# Altium project MyNixie.PrjPCB
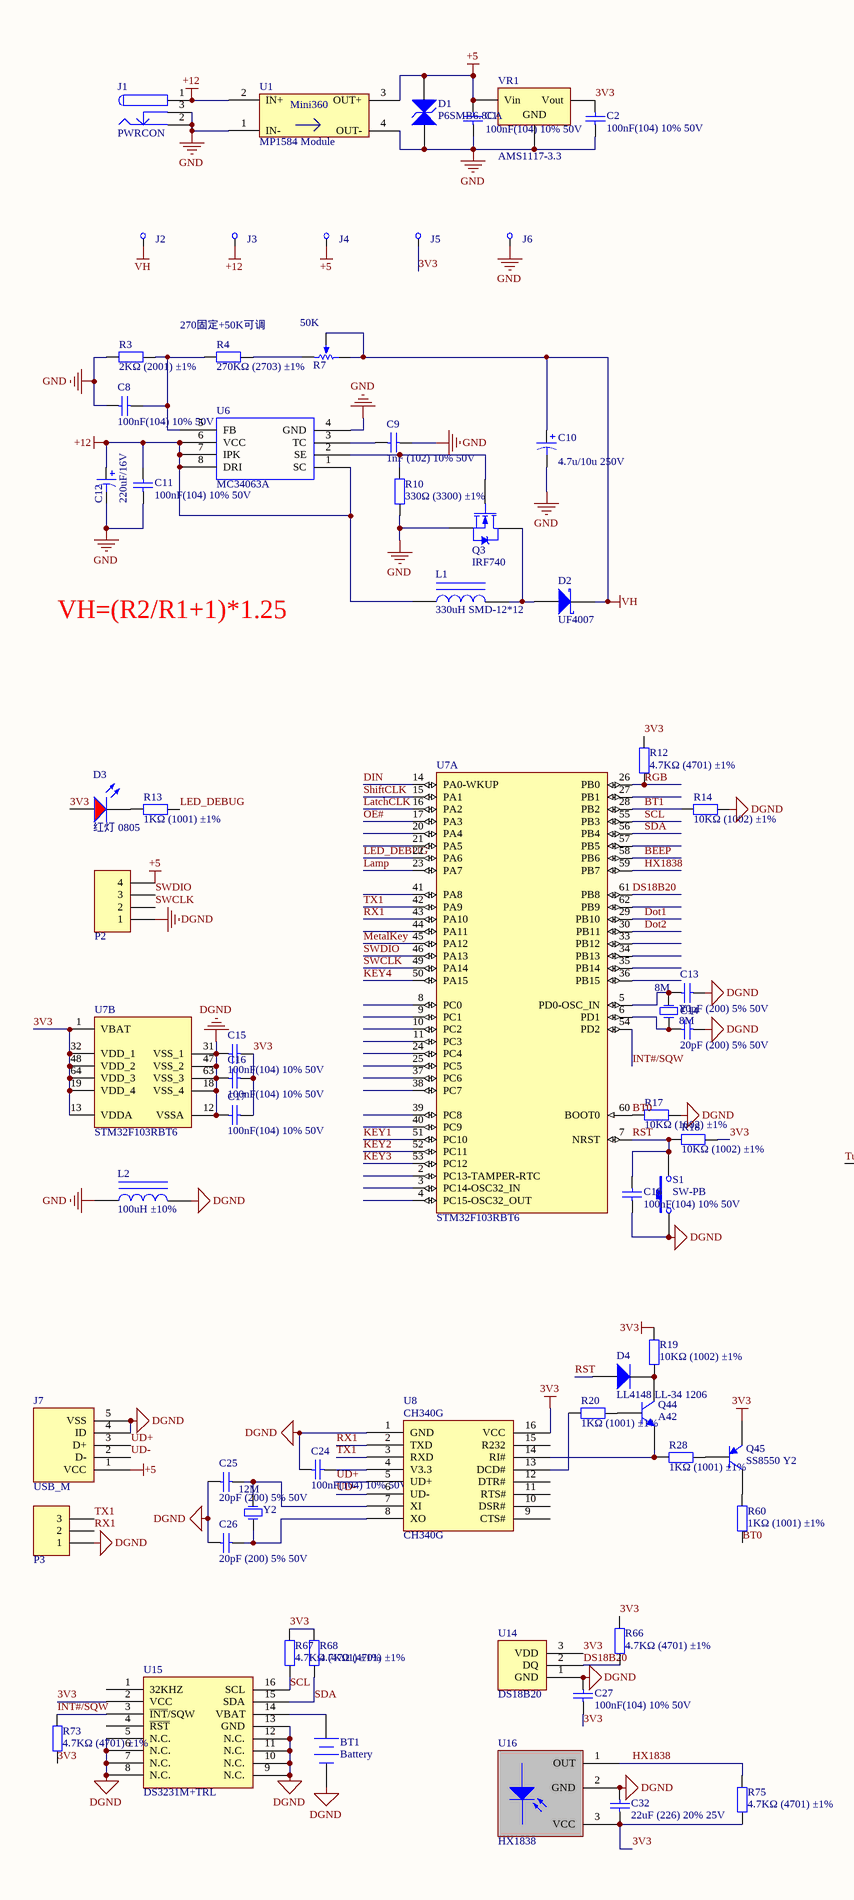
[diagram p0: MyNixie.SchDoc, left]
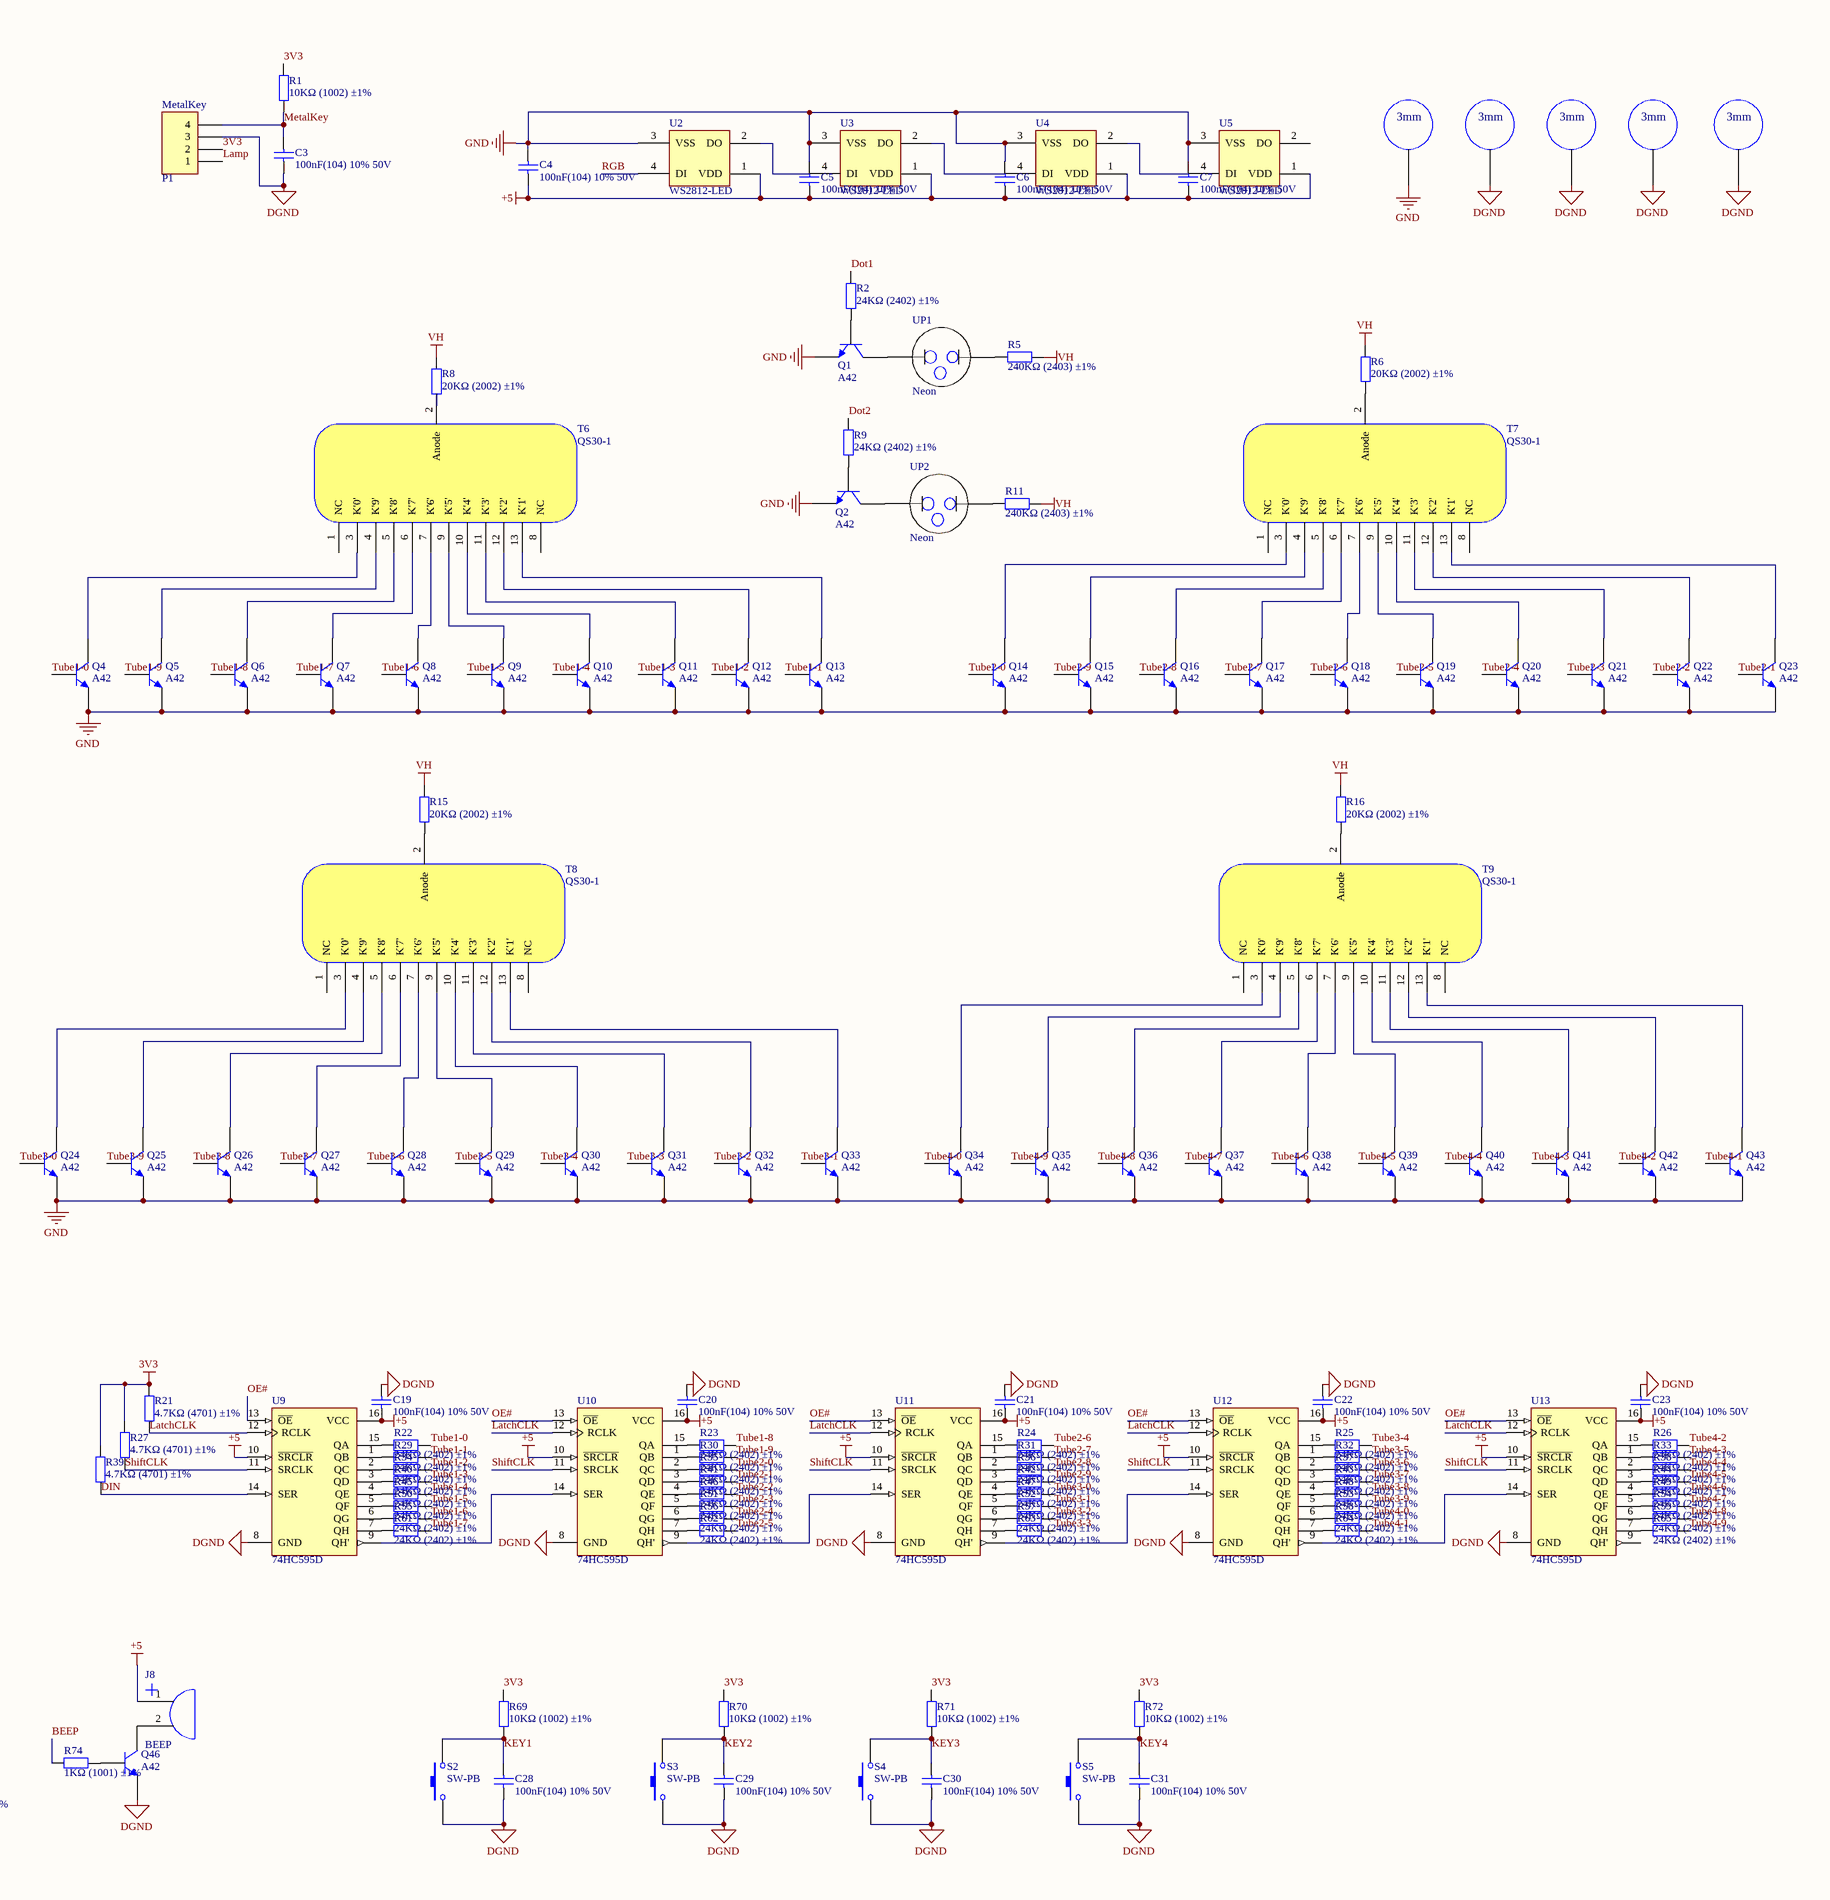
[diagram p1: MyNixie.SchDoc, right]
1 sheet, 206 parts. Net scope: global (net labels, ports and power ports of the same name join across sheets).
Board file: MyNixie.PcbDoc

## Sheet MyNixie.SchDoc
size A2

### Parts
BT1  Battery  [CR1220]
C1  100nF(104) 10% 50V  [0805_C]
C2  100nF(104) 10% 50V  [0805_C]
C3  100nF(104) 10% 50V  [0805_C]
C4  100nF(104) 10% 50V  [0805_C]
C5  100nF(104) 10% 50V  [0805_C]
C6  100nF(104) 10% 50V  [0805_C]
C7  100nF(104) 10% 50V  [0805_C]
C8  100nF(104) 10% 50V  [0805_C]
C9  1nF (102) 10% 50V  [0805_C]
C10  4.7u/10u 250V  [C-RB-8]
C11  100nF(104) 10% 50V  [0805_C]
C12  220uF/16V  [C-RB-S6]
C13  20pF (200) 5% 50V  [0805_C]
C14  20pF (200) 5% 50V  [0805_C]
C15  100nF(104) 10% 50V  [0805_C]
C16  100nF(104) 10% 50V  [0805_C]
C17  100nF(104) 10% 50V  [0805_C]
C18  100nF(104) 10% 50V  [0805_C]
C19  100nF(104) 10% 50V  [0805_C]
C20  100nF(104) 10% 50V  [0805_C]
C21  100nF(104) 10% 50V  [0805_C]
C22  100nF(104) 10% 50V  [0805_C]
C23  100nF(104) 10% 50V  [0805_C]
C24  100nF(104) 10% 50V  [0805_C]
C25  20pF (200) 5% 50V  [0805_C]
C26  20pF (200) 5% 50V  [0805_C]
C27  100nF(104) 10% 50V  [0805_C]
C28  100nF(104) 10% 50V  [0805_C]
C29  100nF(104) 10% 50V  [0805_C]
C30  100nF(104) 10% 50V  [0805_C]
C31  100nF(104) 10% 50V  [0805_C]
C32  22uF (226) 20% 25V  [0805_C]
D1  P6SMB6.8CA  [SMB(DO-214AA)_S1]
D2  UF4007  [SMA(DO-214AC)_S1]
D3  红灯 0805  [0805_LED_S1]
D4  LL4148 LL-34 1206  [LL-34]
J1  PWRCON  [DC-005]
J2  CHECK  [CHECK-B]  (value not drawn)
J3  CHECK  [CHECK-B]  (value not drawn)
J4  CHECK  [CHECK-B]  (value not drawn)
J5  CHECK  [CHECK-B]  (value not drawn)
J6  CHECK  [CHECK-B]  (value not drawn)
J7  USB_M  [USB_MICRO]
J8  BEEP  [Beep-12095]
L1  330uH SMD-12*12  [L-SMD-12]
L2  100uH ±10%  [0805_L]
P1  MetalKey  [HDR4X1_A]
P2  Header 4  [HDR4X1_A]  (value not drawn)
P3  Header 3  [HDR3X1_A]  (value not drawn)
Q1  A42  [SOT-23(SOT-23-3)]
Q2  A42  [SOT-23(SOT-23-3)]
Q3  IRF740  [TO-263-2]
Q4  A42  [SOT-23(SOT-23-3)]
Q5  A42  [SOT-23(SOT-23-3)]
Q6  A42  [SOT-23(SOT-23-3)]
Q7  A42  [SOT-23(SOT-23-3)]
Q8  A42  [SOT-23(SOT-23-3)]
Q9  A42  [SOT-23(SOT-23-3)]
Q10  A42  [SOT-23(SOT-23-3)]
Q11  A42  [SOT-23(SOT-23-3)]
Q12  A42  [SOT-23(SOT-23-3)]
Q13  A42  [SOT-23(SOT-23-3)]
Q14  A42  [SOT-23(SOT-23-3)]
Q15  A42  [SOT-23(SOT-23-3)]
Q16  A42  [SOT-23(SOT-23-3)]
Q17  A42  [SOT-23(SOT-23-3)]
Q18  A42  [SOT-23(SOT-23-3)]
Q19  A42  [SOT-23(SOT-23-3)]
Q20  A42  [SOT-23(SOT-23-3)]
Q21  A42  [SOT-23(SOT-23-3)]
Q22  A42  [SOT-23(SOT-23-3)]
Q23  A42  [SOT-23(SOT-23-3)]
Q24  A42  [SOT-23(SOT-23-3)]
Q25  A42  [SOT-23(SOT-23-3)]
Q26  A42  [SOT-23(SOT-23-3)]
Q27  A42  [SOT-23(SOT-23-3)]
Q28  A42  [SOT-23(SOT-23-3)]
Q29  A42  [SOT-23(SOT-23-3)]
Q30  A42  [SOT-23(SOT-23-3)]
Q31  A42  [SOT-23(SOT-23-3)]
Q32  A42  [SOT-23(SOT-23-3)]
Q33  A42  [SOT-23(SOT-23-3)]
Q34  A42  [SOT-23(SOT-23-3)]
Q35  A42  [SOT-23(SOT-23-3)]
Q36  A42  [SOT-23(SOT-23-3)]
Q37  A42  [SOT-23(SOT-23-3)]
Q38  A42  [SOT-23(SOT-23-3)]
Q39  A42  [SOT-23(SOT-23-3)]
Q40  A42  [SOT-23(SOT-23-3)]
Q41  A42  [SOT-23(SOT-23-3)]
Q42  A42  [SOT-23(SOT-23-3)]
Q43  A42  [SOT-23(SOT-23-3)]
Q44  A42  [SOT-23(SOT-23-3)]
Q45  SS8550 Y2  [SOT-23(SOT-23-3)]
Q46  A42  [SOT-23(SOT-23-3)]
R1  10KΩ (1002) ±1%  [0805_R]
R2  24KΩ (2402) ±1%  [0805_R]
R3  2KΩ (2001) ±1%  [0805_R]
R4  270KΩ (2703) ±1%  [0805_R]
R5  240KΩ (2403) ±1%  [0805_R]
R6  20KΩ (2002) ±1%  [0805_R]
R7  50K  [VR_B1]
R8  20KΩ (2002) ±1%  [0805_R]
R9  24KΩ (2402) ±1%  [0805_R]
R10  330Ω (3300) ±1%  [0805_R]
R11  240KΩ (2403) ±1%  [0805_R]
R12  4.7KΩ (4701) ±1%  [0805_R]
R13  1KΩ (1001) ±1%  [0805_R]
R14  10KΩ (1002) ±1%  [0805_R]
R15  20KΩ (2002) ±1%  [0805_R]
R16  20KΩ (2002) ±1%  [0805_R]
R17  10KΩ (1002) ±1%  [0805_R]
R18  10KΩ (1002) ±1%  [0805_R]
R19  10KΩ (1002) ±1%  [0805_R]
R20  1KΩ (1001) ±1%  [0805_R]
R21  4.7KΩ (4701) ±1%  [0805_R]
R22  24KΩ (2402) ±1%  [0805_R]
R23  24KΩ (2402) ±1%  [0805_R]
R24  24KΩ (2402) ±1%  [0805_R]
R25  24KΩ (2402) ±1%  [0805_R]
R26  24KΩ (2402) ±1%  [0805_R]
R27  4.7KΩ (4701) ±1%  [0805_R]
R28  1KΩ (1001) ±1%  [0805_R]
R29  24KΩ (2402) ±1%  [0805_R]
R30  24KΩ (2402) ±1%  [0805_R]
R31  24KΩ (2402) ±1%  [0805_R]
R32  24KΩ (2402) ±1%  [0805_R]
R33  24KΩ (2402) ±1%  [0805_R]
R34  24KΩ (2402) ±1%  [0805_R]
R35  24KΩ (2402) ±1%  [0805_R]
R36  24KΩ (2402) ±1%  [0805_R]
R37  24KΩ (2402) ±1%  [0805_R]
R38  24KΩ (2402) ±1%  [0805_R]
R39  4.7KΩ (4701) ±1%  [0805_R]
R40  24KΩ (2402) ±1%  [0805_R]
R41  24KΩ (2402) ±1%  [0805_R]
R42  24KΩ (2402) ±1%  [0805_R]
R43  24KΩ (2402) ±1%  [0805_R]
R44  24KΩ (2402) ±1%  [0805_R]
R45  24KΩ (2402) ±1%  [0805_R]
R46  24KΩ (2402) ±1%  [0805_R]
R47  24KΩ (2402) ±1%  [0805_R]
R48  24KΩ (2402) ±1%  [0805_R]
R49  24KΩ (2402) ±1%  [0805_R]
R50  24KΩ (2402) ±1%  [0805_R]
R51  24KΩ (2402) ±1%  [0805_R]
R52  24KΩ (2402) ±1%  [0805_R]
R53  24KΩ (2402) ±1%  [0805_R]
R54  24KΩ (2402) ±1%  [0805_R]
R55  24KΩ (2402) ±1%  [0805_R]
R56  24KΩ (2402) ±1%  [0805_R]
R57  24KΩ (2402) ±1%  [0805_R]
R58  24KΩ (2402) ±1%  [0805_R]
R59  24KΩ (2402) ±1%  [0805_R]
R60  1KΩ (1001) ±1%  [0805_R]
R61  24KΩ (2402) ±1%  [0805_R]
R62  24KΩ (2402) ±1%  [0805_R]
R63  24KΩ (2402) ±1%  [0805_R]
R64  24KΩ (2402) ±1%  [0805_R]
R65  24KΩ (2402) ±1%  [0805_R]
R66  4.7KΩ (4701) ±1%  [0805_R]
R67  4.7KΩ (4701) ±1%  [0805_R]
R68  4.7KΩ (4701) ±1%  [0805_R]
R69  10KΩ (1002) ±1%  [0805_R]
R70  10KΩ (1002) ±1%  [0805_R]
R71  10KΩ (1002) ±1%  [0805_R]
R72  10KΩ (1002) ±1%  [0805_R]
R73  4.7KΩ (4701) ±1%  [0805_R]
R74  1KΩ (1001) ±1%  [0805_R]
R75  4.7KΩ (4701) ±1%  [0805_R]
S1  SW-PB  [SW_PB2_A1]
S2  SW-PB  [SW_PB2_A1]
S3  SW-PB  [SW_PB2_A1]
S4  SW-PB  [SW_PB2_A1]
S5  SW-PB  [SW_PB2_A1]
T1  M3铜柱螺丝孔  [螺丝孔-3mm]  (value not drawn)
T2  M3铜柱螺丝孔  [螺丝孔-3mm]  (value not drawn)
T3  M3铜柱螺丝孔  [螺丝孔-3mm]  (value not drawn)
T4  M3铜柱螺丝孔  [螺丝孔-3mm]  (value not drawn)
T5  M3铜柱螺丝孔  [螺丝孔-3mm]  (value not drawn)
T6  QS30-1  [QS30-1]
T7  QS30-1  [QS30-1]
T8  QS30-1  [QS30-1]
T9  QS30-1  [QS30-1]
U1  MP1584 Module  [MP1584 Module]
U2  WS2812-LED  [WS2812]
U3  WS2812-LED  [WS2812]
U4  WS2812-LED  [WS2812]
U5  WS2812-LED  [WS2812]
U6  MC34063A  [SOIC-8_150mil]
U7  STM32F103RBT6  [LQFP-64_10x10x05P]  (parts A,B of 2)
U8  CH340G  [SOIC-16_150mil]
U9  74HC595D  [SOIC-16_150mil]
U10  74HC595D  [SOIC-16_150mil]
U11  74HC595D  [SOIC-16_150mil]
U12  74HC595D  [SOIC-16_150mil]
U13  74HC595D  [SOIC-16_150mil]
U14  DS18B20  [TO-92A]
U15  DS3231M+TRL  [SOIC-16_300mil]
U16  HX1838  [HS0038B]
UP1  Neon  [Neon]
UP2  Neon  [Neon]
VR1  AMS1117-3.3  [SOT-223]
Y1  8M  [X-SM49]
Y2  12M  [X-SM49]

### Nets
3V3: C2.2 C15.1 C16.1 C17.1 C27.2 C32.1 D3.A J5.1 P1.2 Q45.2(E) R1.1 R12.2 R18.1 R19.2 R21.1 R27.1 R39.1 R66.2 R67.2 R68.2 R69.1 R70.1 R71.1 R72.1 R73.1 R75.1 U7.1(VBAT) U7.13(VDDA) U7.19(VDD_4) U7.32(VDD_1) U7.48(VDD_2) U7.64(VDD_3) U8.16(VCC) U14.3(VDD) U15.2(VCC) U16.3(VCC) VR1.2(Vout)
+5: C1.2 C4.1 C5.1 C6.1 C7.1 C19.1 C20.1 C21.1 C22.1 C23.1 D1.1(A) J4.1 J7.1(VCC) J8.1 P2.4 U1.3(OUT+) U2.1(VDD) U3.1(VDD) U4.1(VDD) U5.1(VDD) U9.10(~{SRCLR}) U9.16(VCC) U10.10(~{SRCLR}) U10.16(VCC) U11.10(~{SRCLR}) U11.16(VCC) U12.10(~{SRCLR}) U12.16(VCC) U13.10(~{SRCLR}) U13.16(VCC) VR1.3(Vin)
+12: C11.2 C12.1 J1.1 J3.1 L1.1 U1.2(IN+) U6.1(SC) U6.6(VCC) U6.7(IPK) U6.8(DRI)
DGND: BT1.2(-) C3.1 C13.1 C14.1 C15.2 C16.2 C17.2 C18.1 C19.2 C20.2 C21.2 C22.2 C23.2 C24.2 C25.2 C26.2 C27.1 C28.1 C29.1 C30.1 C31.1 C32.2 J7.4(ID) J7.5(VSS) L2.2 P1.3 P2.1 P3.1 Q46.2(E) R14.1 R17.1 S1.2 S2.1 S3.1 S4.1 S5.1 T2.1 T3.1 T4.1 T5.1 U7.12(VSSA) U7.18(VSS_4) U7.31(VSS_1) U7.47(VSS_2) U7.63(VSS_3) U8.1(GND) U9.8(GND) U10.8(GND) U11.8(GND) U12.8(GND) U13.8(GND) U14.1(GND) U15.5(N.C.) U15.6(N.C.) U15.7(N.C.) U15.8(N.C.) U15.9(N.C.) U15.10(N.C.) U15.11(N.C.) U15.12(N.C.) U15.13(GND) U16.2(GND)
GND: C1.1 C2.1 C4.2 C5.2 C6.2 C7.2 C8.1 C9.2 C10.2 C11.1 C12.2 D1.2(K) J1.2 J1.3 J6.1 L2.1 Q1.2(E) Q2.2(E) Q3.3(S) Q4.2(E) Q5.2(E) Q6.2(E) Q7.2(E) Q8.2(E) Q9.2(E) Q10.2(E) Q11.2(E) Q12.2(E) Q13.2(E) Q14.2(E) Q15.2(E) Q16.2(E) Q17.2(E) Q18.2(E) Q19.2(E) Q20.2(E) Q21.2(E) Q22.2(E) Q23.2(E) Q24.2(E) Q25.2(E) Q26.2(E) Q27.2(E) Q28.2(E) Q29.2(E) Q30.2(E) Q31.2(E) Q32.2(E) Q33.2(E) Q34.2(E) Q35.2(E) Q36.2(E) Q37.2(E) Q38.2(E) Q39.2(E) Q40.2(E) Q41.2(E) Q42.2(E) Q43.2(E) R3.1 R10.1 T1.1 U1.1(IN-) U1.4(OUT-) U2.3(VSS) U3.3(VSS) U4.3(VSS) U5.3(VSS) U6.4(GND) VR1.1(GND)
VH: C10.1 D2.2(K) J2.1 R5.2 R6.2 R7.1(TOP) R7.2(TAP) R8.2 R11.2 R15.2 R16.2
BEEP: R74.1 U7.58(PB6)
BT0: R17.2 R60.1 U7.60(BOOT0)
BT1: R14.2 U7.28(PB2)
DIN: R39.2 U7.14(PA0-WKUP) U9.14(SER)
Dot1: R2.2 U7.29(PB10)
Dot2: R9.2 U7.30(PB11)
DS18B20: R66.1 U7.61(PB8) U14.2(DQ)
HX1838: R75.2 U7.59(PB7) U16.1(OUT)
INT#/SQW: R73.2 U7.54(PD2) U15.3(~{INT}/SQW)
KEY1: C28.2 R69.2 S2.2 U7.51(PC10)
KEY2: C29.2 R70.2 S3.2 U7.52(PC11)
KEY3: C30.2 R71.2 S4.2 U7.53(PC12)
KEY4: C31.2 R72.2 S5.2 U7.50(PA15)
Lamp: P1.1 U7.23(PA7)
LatchCLK: R21.2 U7.16(PA2) U9.12(RCLK) U10.12(RCLK) U11.12(RCLK) U12.12(RCLK) U13.12(RCLK)
LED_DEBUG: R13.2 U7.22(PA6)
MetalKey: C3.2 P1.4 R1.2 U7.45(PA12)
OE#: U7.17(PA3) U9.13(~{OE}) U10.13(~{OE}) U11.13(~{OE}) U12.13(~{OE}) U13.13(~{OE})
RGB: R12.1 U2.4(DI) U7.26(PB0)
RST: C18.2 D4.1(A) R18.2 S1.1 U7.7(NRST)
RX1: P3.2 U7.43(PA10) U8.2(TXD)
SCL: R67.1 U7.55(PB3) U15.16(SCL)
SDA: R68.1 U7.56(PB4) U15.15(SDA)
ShiftCLK: R27.2 U7.15(PA1) U9.11(SRCLK) U10.11(SRCLK) U11.11(SRCLK) U12.11(SRCLK) U13.11(SRCLK)
SWCLK: P2.2 U7.49(PA14)
SWDIO: P2.3 U7.46(PA13)
Tube1-0: Q4.1(B) R22.2
Tube1-1: Q13.1(B) R29.2
Tube1-2: Q12.1(B) R34.2
Tube1-3: Q11.1(B) R40.2
Tube1-4: Q10.1(B) R45.2
Tube1-5: Q9.1(B) R50.2
Tube1-6: Q8.1(B) R55.2
Tube1-7: Q7.1(B) R61.2
Tube1-8: Q6.1(B) R23.2
Tube1-9: Q5.1(B) R30.2
Tube2-0: Q14.1(B) R35.2
Tube2-1: Q23.1(B) R41.2
Tube2-2: Q22.1(B) R46.2
Tube2-3: Q21.1(B) R51.2
Tube2-4: Q20.1(B) R56.2
Tube2-5: Q19.1(B) R62.2
Tube2-6: Q18.1(B) R24.2
Tube2-7: Q17.1(B) R31.2
Tube2-8: Q16.1(B) R36.2
Tube2-9: Q15.1(B) R42.2
Tube3-0: Q24.1(B) R47.2
Tube3-1: Q33.1(B) R52.2
Tube3-2: Q32.1(B) R57.2
Tube3-3: Q31.1(B) R63.2
Tube3-4: Q30.1(B) R25.2
Tube3-5: Q29.1(B) R32.2
Tube3-6: Q28.1(B) R37.2
Tube3-7: Q27.1(B) R43.2
Tube3-8: Q26.1(B) R48.2
Tube3-9: Q25.1(B) R53.2
Tube4-0: Q34.1(B) R58.2
Tube4-1: Q43.1(B) R64.2
Tube4-2: Q42.1(B) R26.2
Tube4-3: Q41.1(B) R33.2
Tube4-4: Q40.1(B) R38.2
Tube4-5: Q39.1(B) R44.2
Tube4-6: Q38.1(B) R49.2
Tube4-7: Q37.1(B) R54.2
Tube4-8: Q36.1(B) R59.2
Tube4-9: Q35.1(B) R65.2
TX1: P3.3 U7.42(PA9) U8.3(RXD)
UD+: J7.3(D+) U8.5(UD+)
UD-: J7.2(D-) U8.6(UD-)
NetBT1_1: BT1.1(+) U15.14(VBAT)
NetC8_2: C8.2 R3.2 R4.1 U6.5(FB)
NetC9_1: C9.1 U6.3(TC)
NetC13_2: C13.2 U7.5(PD0-OSC_IN) Y1.1(OSC1)
NetC14_2: C14.2 U7.6(PD1) Y1.2(OSC2)
NetC24_1: C24.1 U8.4(V3.3)
NetC25_1: C25.1 U8.7(XI) Y2.1(OSC1)
NetC26_1: C26.1 U8.8(XO) Y2.2(OSC2)
NetD2_1: D2.1(A) L1.2 Q3.2(D)
NetD3_K: D3.K R13.1
NetD4_2: D4.2(K) Q44.3(C) R19.1
NetJ8_2: J8.2 Q46.3(C)
NetQ1_1: Q1.1(B) R2.1
NetQ1_3: Q1.3(C) UP1.2
NetQ2_1: Q2.1(B) R9.1
NetQ2_3: Q2.3(C) UP2.2
NetQ3_1: Q3.1(G) R10.2 U6.2(SE)
NetQ4_3: Q4.3(C) T6.3(K'0')
NetQ5_3: Q5.3(C) T6.4(K'9')
NetQ6_3: Q6.3(C) T6.5(K'8')
NetQ7_3: Q7.3(C) T6.6(K'7')
NetQ8_3: Q8.3(C) T6.7(K'6')
NetQ9_3: Q9.3(C) T6.9(K'5')
NetQ10_3: Q10.3(C) T6.10(K'4')
NetQ11_3: Q11.3(C) T6.11(K'3')
NetQ12_3: Q12.3(C) T6.12(K'2')
NetQ13_3: Q13.3(C) T6.13(K'1')
NetQ14_3: Q14.3(C) T7.3(K'0')
NetQ15_3: Q15.3(C) T7.4(K'9')
NetQ16_3: Q16.3(C) T7.5(K'8')
NetQ17_3: Q17.3(C) T7.6(K'7')
NetQ18_3: Q18.3(C) T7.7(K'6')
NetQ19_3: Q19.3(C) T7.9(K'5')
NetQ20_3: Q20.3(C) T7.10(K'4')
NetQ21_3: Q21.3(C) T7.11(K'3')
NetQ22_3: Q22.3(C) T7.12(K'2')
NetQ23_3: Q23.3(C) T7.13(K'1')
NetQ24_3: Q24.3(C) T8.3(K'0')
NetQ25_3: Q25.3(C) T8.4(K'9')
NetQ26_3: Q26.3(C) T8.5(K'8')
NetQ27_3: Q27.3(C) T8.6(K'7')
NetQ28_3: Q28.3(C) T8.7(K'6')
NetQ29_3: Q29.3(C) T8.9(K'5')
NetQ30_3: Q30.3(C) T8.10(K'4')
NetQ31_3: Q31.3(C) T8.11(K'3')
NetQ32_3: Q32.3(C) T8.12(K'2')
NetQ33_3: Q33.3(C) T8.13(K'1')
NetQ34_3: Q34.3(C) T9.3(K'0')
NetQ35_3: Q35.3(C) T9.4(K'9')
NetQ36_3: Q36.3(C) T9.5(K'8')
NetQ37_3: Q37.3(C) T9.6(K'7')
NetQ38_3: Q38.3(C) T9.7(K'6')
NetQ39_3: Q39.3(C) T9.9(K'5')
NetQ40_3: Q40.3(C) T9.10(K'4')
NetQ41_3: Q41.3(C) T9.11(K'3')
NetQ42_3: Q42.3(C) T9.12(K'2')
NetQ43_3: Q43.3(C) T9.13(K'1')
NetQ44_1: Q44.1(B) R20.2
NetQ44_2: Q44.2(E) R28.1 U8.14(RI#)
NetQ45_1: Q45.1(B) R28.2
NetQ45_3: Q45.3(C) R60.2
NetQ46_1: Q46.1(B) R74.2
NetR4_2: R4.2 R7.3(BOT)
NetR5_1: R5.1 UP1.1
NetR6_1: R6.1 T7.2(Anode)
NetR8_1: R8.1 T6.2(Anode)
NetR11_1: R11.1 UP2.1
NetR15_1: R15.1 T8.2(Anode)
NetR16_1: R16.1 T9.2(Anode)
NetR20_1: R20.1 U8.13(DCD#)
NetR22_1: R22.1 U9.15(QA)
NetR23_1: R23.1 U10.15(QA)
NetR24_1: R24.1 U11.15(QA)
NetR25_1: R25.1 U12.15(QA)
NetR26_1: R26.1 U13.15(QA)
NetR29_1: R29.1 U9.1(QB)
NetR30_1: R30.1 U10.1(QB)
NetR31_1: R31.1 U11.1(QB)
NetR32_1: R32.1 U12.1(QB)
NetR33_1: R33.1 U13.1(QB)
NetR34_1: R34.1 U9.2(QC)
NetR35_1: R35.1 U10.2(QC)
NetR36_1: R36.1 U11.2(QC)
NetR37_1: R37.1 U12.2(QC)
NetR38_1: R38.1 U13.2(QC)
NetR40_1: R40.1 U9.3(QD)
NetR41_1: R41.1 U10.3(QD)
NetR42_1: R42.1 U11.3(QD)
NetR43_1: R43.1 U12.3(QD)
NetR44_1: R44.1 U13.3(QD)
NetR45_1: R45.1 U9.4(QE)
NetR46_1: R46.1 U10.4(QE)
NetR47_1: R47.1 U11.4(QE)
NetR48_1: R48.1 U12.4(QE)
NetR49_1: R49.1 U13.4(QE)
NetR50_1: R50.1 U9.5(QF)
NetR51_1: R51.1 U10.5(QF)
NetR52_1: R52.1 U11.5(QF)
NetR53_1: R53.1 U12.5(QF)
NetR54_1: R54.1 U13.5(QF)
NetR55_1: R55.1 U9.6(QG)
NetR56_1: R56.1 U10.6(QG)
NetR57_1: R57.1 U11.6(QG)
NetR58_1: R58.1 U12.6(QG)
NetR59_1: R59.1 U13.6(QG)
NetR61_1: R61.1 U9.7(QH)
NetR62_1: R62.1 U10.7(QH)
NetR63_1: R63.1 U11.7(QH)
NetR64_1: R64.1 U12.7(QH)
NetR65_1: R65.1 U13.7(QH)
NetU2_2: U2.2(DO) U3.4(DI)
NetU3_2: U3.2(DO) U4.4(DI)
NetU4_2: U4.2(DO) U5.4(DI)
NetU9_9: U9.9(QH') U10.14(SER)
NetU10_9: U10.9(QH') U11.14(SER)
NetU11_9: U11.9(QH') U12.14(SER)
NetU12_9: U12.9(QH') U13.14(SER)

Not connected (* = marked no-connect by the designer): T6 1(NC) 8(NC); T7 1(NC) 8(NC); T8 1(NC) 8(NC); T9 1(NC) 8(NC); U5 2(DO); U7 2(PC13-TAMPER-RTC) 3(PC14-OSC32_IN) 4(PC15-OSC32_OUT) 8(PC0) 9(PC1) 10(PC2) 11(PC3) 20(PA4) 21(PA5) 24(PC4) 25(PC5) 27(PB1) 33(PB12) 34(PB13) 35(PB14) 36(PB15) 37(PC6) 38(PC7) 39(PC8) 40(PC9) 41(PA8) 44(PA11) 57(PB5) 62(PB9); U8 9(CTS#) 10(DSR#) 11(RTS#) 12(DTR#) 15(R232); U13 9(QH'); U15 1(32KHZ) 4(~{RST})

### Notes on the sheet
- (near R4) 270固定+50K可调
- VH=(R2/R1+1)*1.25
- (in symbol M3铜柱螺丝孔) 3mm
- (in symbol MP1584 Module) Mini360

### Library data of the parts
BT1 = Battery: 备份电池; Published: 24-Mar-1999; LatestRevisionDate: 17-Jul-2002; LatestRevisionNote: Re-released for DXP Platform.; PackageReference: BAT-2; Publisher: Altium Limited
C1-C8 C11 C15-C24 C27-C31 = 0805 100nF(104) 10% 50V: 贴片电容; ComponentLink1Description: 供应商链接; ComponentLink1URL: http://www.szlcsc.com/product/details_50686.html; Package: 0805; Supplier: LC; SuppliersPartNumber: C49678
C9 = 0805 1nF (102) 10% 50V: 贴片电容; ComponentLink1Description: 供应商链接; ComponentLink1URL: http://www.szlcsc.com/product/details_52223.html; Package: 0805; Supplier: LC; SuppliersPartNumber: C51210
C10 C12 = Cap Pol1: 极性电解电容; Published: 8-Jun-2000; LatestRevisionDate: 17-Jul-2002; LatestRevisionNote: Re-released for DXP Platform.; PackageReference: RB7.6-15; Publisher: Altium Limited; PackageDescription: Polarized Capacitor (Radial); 2 Leads
  C10: Value: 4.7u/10u 250V
  C12: Value: 220uF/16V
C13 C14 C25 C26 = 0805 20pF (200) 5% 50V: 贴片电容; ComponentLink1Description: 供应商链接; ComponentLink1URL: http://www.szlcsc.com/product/details_2150.html; Package: 0805; Supplier: LC; SuppliersPartNumber: C1798
C32 = 0805 22uF (226) 20% 25V: 贴片电容; ComponentLink1Description: 供应商链接; ComponentLink1URL: http://www.szlcsc.com/product/details_46786.html; Package: 0805; Supplier: LC; SuppliersPartNumber: C45783
D1 = SMB/DO-214AA P6SMB6.8CA: TVS; ComponentLink1Description: 供应商链接; ComponentLink1URL: http://www.szlcsc.com/product/details_79530.html; Package: SMB/DO-214AA; Supplier: LC; SuppliersPartNumber: C78395
D2 = D Schottky: Schottky Diode; Published: 8-Jun-2000; LatestRevisionDate: 17-Jul-2002; LatestRevisionNote: Re-released for DXP Platform.; PackageReference: SMB; Publisher: Altium Limited; PackageDescription: DO-214-AA/SMB; 2 C-Bend Leads; Body 5.3 x 3.6 mm, inc. leads (LxW); Code_JEDEC: DO-214-AA
D3 = 0805 红灯: 发光二极管; ComponentLink1Description: 供应商链接; ComponentLink1URL: http://www.szlcsc.com/product/details_2668.html; Package: 0805; Supplier: LC; SuppliersPartNumber: C2295
D4 = LL-34 LL4148 LL-34 1206: 开关二极管; ComponentLink1Description: 供应商链接; ComponentLink1URL: http://www.szlcsc.com/product/details_10338.html; Package: LL-34; Supplier: LC; SuppliersPartNumber: C9808
J1 = PWRCON: 直流电源端子; Published: 17-Dec-2003; DatasheetDocument: 09-May-2002; Publisher: Altium Limited; ComponentLink1Description: Manufacturer Link; ComponentLink1URL: http://domino.kycon.com/internet/Products.html
J2-J6 = CHECK: 测试点
J7 = USB_M: MicroUSB接口
J8 = BEEP: 蜂鸣器
L1 = Inductor Iron: Magnetic-Core Inductor; Published: 24-Mar-1999; LatestRevisionDate: 17-Jul-2002; LatestRevisionNote: Re-released for DXP Platform.; PackageReference: AXIAL-0.9; Publisher: Altium Limited; PackageDescription: Axial Device, Thru-Hole; 2 Leads; 0.9 in Pin Spacing
L2 = 0805 100uH 10%: 贴片电感; ComponentLink1Description: 供应商链接; ComponentLink1URL: http://www.szlcsc.com/product/details_69137.html; Package: 0805; Supplier: LC; SuppliersPartNumber: C68035
P1 P2 = Header 4: 接插件; LatestRevisionDate: 17-Jul-2002; LatestRevisionNote: Re-released for DXP Platform.; Publisher: Altium Limited
P3 = Header 3: 接插件; LatestRevisionDate: 17-Jul-2002; LatestRevisionNote: Re-released for DXP Platform.; Publisher: Altium Limited
Q1 Q2 Q4-Q44 Q46 = SOT-23 SS8050 Y1: 三极管; ComponentLink1Description: 供应商链接; ComponentLink1URL: http://www.szlcsc.com/product/details_2507.html; Package: SOT-23; Supplier: LC; SuppliersPartNumber: C2150
Q3 = NMOS-2: N-Channel Power MOSFET; Note: Pin 2 is electrically connected to pin 4.; Published: 8-Jun-2000; LatestRevisionDate: 17-Jul-2002; LatestRevisionNote: Re-released for DXP Platform.; DatasheetVersion: PD-9.814; PackageVersion: Feb-1997; PackageReference: TO-220AB; Publisher: Altium Limited; PackageDescription: TO, Thru-Hole, Vertical, Heatsink Mounted; 3 In-Line Leads; Pitch 2.54 mm; ComponentLink1Description: Manufacturer Link; ComponentLink1URL: http://www.irf.com/
Q45 = SOT-23 SS8550 Y2: 三极管; ComponentLink1Description: 供应商链接; ComponentLink1URL: http://www.szlcsc.com/product/details_9037.html; Package: SOT-23; Supplier: LC; SuppliersPartNumber: C8542
R1 R14 R17-R19 R69-R72 = 0805 10KΩ (1002) 1%: 贴片电阻; ComponentLink1Description: 供应商链接; ComponentLink1URL: http://www.szlcsc.com/product/details_18102.html; Package: 0805; Supplier: LC; SuppliersPartNumber: C17414
R2 R9 R22-R26 R29-R38 R40-R59 R61-R65 = 0805 24KΩ (2402) 1%: 贴片电阻; ComponentLink1Description: 供应商链接; ComponentLink1URL: http://www.szlcsc.com/product/details_18263.html; Package: 0805; Supplier: LC; SuppliersPartNumber: C17575
R3 = 0805 2KΩ (2001) 1%: 贴片电阻; ComponentLink1Description: 供应商链接; ComponentLink1URL: http://www.szlcsc.com/product/details_18292.html; Package: 0805; Supplier: LC; SuppliersPartNumber: C17604
R4 = 0805 270KΩ (2703) 1%: 贴片电阻; ComponentLink1Description: 供应商链接; ComponentLink1URL: http://www.szlcsc.com/product/details_18277.html; Package: 0805; Supplier: LC; SuppliersPartNumber: C17589
R5 R11 = 0805 240KΩ (2403) 1%: 贴片电阻; ComponentLink1Description: 供应商链接; ComponentLink1URL: http://www.szlcsc.com/product/details_26567.html; Package: 0805; Supplier: LC; SuppliersPartNumber: C25824
R6 R8 R15 R16 = 0805 20KΩ (2002) 1%: 贴片电阻; ComponentLink1Description: 供应商链接; ComponentLink1URL: http://www.szlcsc.com/product/details_4735.html; Package: 0805; Supplier: LC; SuppliersPartNumber: C4328
R7 = RES-RPot: 精密可调电阻; Sim Note: Enter the Resistance value and the set point into parameter fields.; Set Position: 0.5; Published: 8-Jun-2000; LatestRevisionDate: 17-Jul-2002; LatestRevisionNote: Re-released for DXP Platform.; PackageReference: VR5; Publisher: Altium Limited; Value: 50K
R10 = 0805 330Ω (3300) 1%: 贴片电阻; ComponentLink1Description: 供应商链接; ComponentLink1URL: http://www.szlcsc.com/product/details_18318.html; Package: 0805; Supplier: LC; SuppliersPartNumber: C17630
R12 R21 R27 R39 R66-R68 R73 R75 = 0805 4.7KΩ (4701) 1%: 贴片电阻; ComponentLink1Description: 供应商链接; ComponentLink1URL: http://www.szlcsc.com/product/details_18361.html; Package: 0805; Supplier: LC; SuppliersPartNumber: C17673
R13 R20 R28 R60 R74 = 0805 1KΩ (1001) 1%: 贴片电阻; ComponentLink1Description: 供应商链接; ComponentLink1URL: http://www.szlcsc.com/product/details_18201.html; Package: 0805; Supplier: LC; SuppliersPartNumber: C17513
S1-S5 = SW-PB: 微动开关; Published: 24-Mar-1999; LatestRevisionDate: 17-Jul-2002; LatestRevisionNote: Re-released for DXP Platform.; PackageReference: SPST-2; Publisher: Altium Limited
T6-T9 = QS30-1: 南昌辉光管
U7 = STM32F103RBT6: ARM; ComponentLink1Description: 供应商链接; ComponentLink1URL: http://www.szlcsc.com/product/details_9244.html; Package: LQFP-64_10x10x05P; Supplier: LC; SuppliersPartNumber: C8735
U8 = CH340G_[C14267]: USB; ComponentLink1Description: 供应商链接; ComponentLink1URL: http://www.szlcsc.com/product/details_14927.html; Package: SOIC-16_150mil; Supplier: LC; SuppliersPartNumber: C14267
U9-U13 = 74HC595D: 74系列逻辑芯片; ComponentLink1Description: 供应商链接; ComponentLink1URL: http://www.szlcsc.com/product/details_6413.html; Package: SOIC-16_150mil; Supplier: LC; SuppliersPartNumber: C5947
U14 = DS18B20: 温度传感器
U15 = DS3231M+TRL: 实时时钟; ComponentLink1Description: 供应商链接; ComponentLink1URL: http://www.szlcsc.com/product/details_38643.html; Package: SOIC-16_300mil; Supplier: LC; SuppliersPartNumber: C37663
U16 = HS0038B: 红外接收器
UP1 UP2 = Neon: 氖泡
VR1 = SOT-223 AMS1117-3.3: 低压差线性稳压(LDO); ComponentLink1Description: 供应商链接; ComponentLink1URL: http://www.szlcsc.com/product/details_6652.html; Package: SOT-223; Supplier: LC; SuppliersPartNumber: C6186
Y1 Y2 = XTAL: 晶振; Published: 8-Jun-2000; LatestRevisionDate: 17-Jul-2002; LatestRevisionNote: Re-released for DXP Platform.; PackageReference: R38; Publisher: Altium Limited
  Y1: Value: 8M
  Y2: Value: 12M